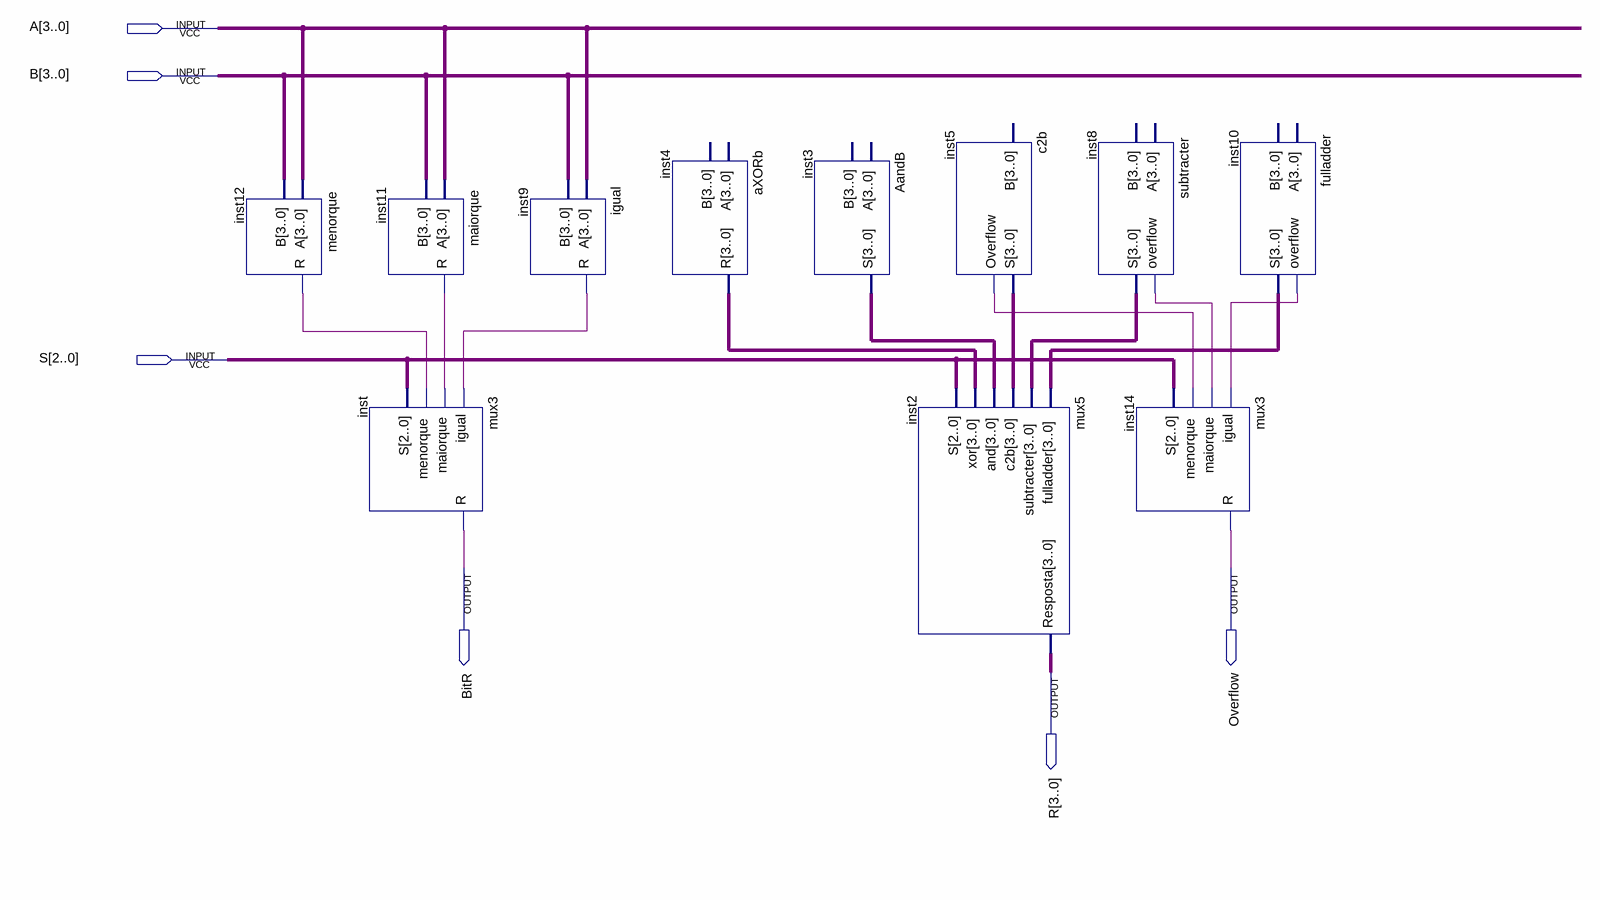
[diagram p0: schematic sheet]
// Quartus schematic ULAIP.bdf as structural Verilog: 11 symbols, 6 pins
module ULAIP (
  input  [3:0] A,
  input  [3:0] B,
  input  [2:0] S,
  output BitR,
  output Overflow,
  output [3:0] R
);

  wire inst5_overflow, inst8_overflow, inst9_r, inst10_overflow, inst11_r, inst12_r;
  wire [3:0] inst3_s, inst4_r, inst5_s, inst8_s, inst10_s;

  menorque inst12 (.A(A), .B(B), .R(inst12_r));
  maiorque inst11 (.A(A), .B(B), .R(inst11_r));
  mux3 inst (.igual(inst9_r), .maiorque(inst11_r), .menorque(inst12_r), .S(S), .R(BitR));
  igual inst9 (.A(A), .B(B), .R(inst9_r));
  aXORb inst4 (.R(inst4_r));  // open: A, B
  AandB inst3 (.S(inst3_s));  // open: A, B
  mux5 inst2 (
    .fulladder(inst10_s), .subtracter(inst8_s), .c2b(inst5_s), .\and (inst3_s), .\xor (inst4_r), .S(S),
    .Resposta(R));
  c2b inst5 (.S(inst5_s), .Overflow(inst5_overflow));  // open: B
  subtracter inst8 (.overflow(inst8_overflow), .S(inst8_s));  // open: A, B
  mux3 inst14 (.igual(inst10_overflow), .maiorque(inst8_overflow), .menorque(inst5_overflow), .S(S), .R(Overflow));
  fulladder inst10 (.overflow(inst10_overflow), .S(inst10_s));  // open: A, B
endmodule
